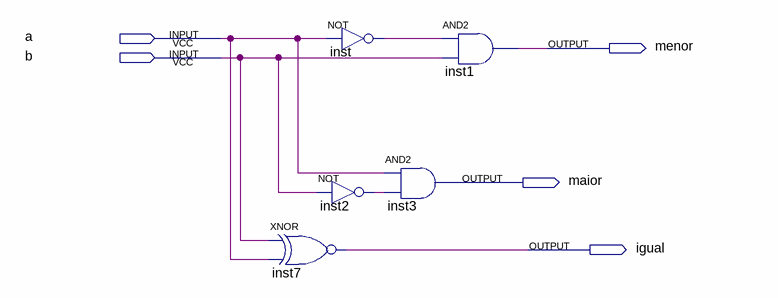
[diagram p0: schematic sheet]
// Quartus schematic comparadorBasico.bdf as structural Verilog: 5 symbols, 5 pins
module comparadorBasico (
  input  a,
  input  b,
  output menor,
  output maior,
  output igual
);

  wire inst2_out, inst_out;

  xnor inst7 (igual, b, a);
  not inst (inst_out, a);
  not inst2 (inst2_out, b);
  and inst3 (maior, a, inst2_out);
  and inst1 (menor, inst_out, b);
endmodule
